# Altium schematic sheet Sensor.SchDoc
size A
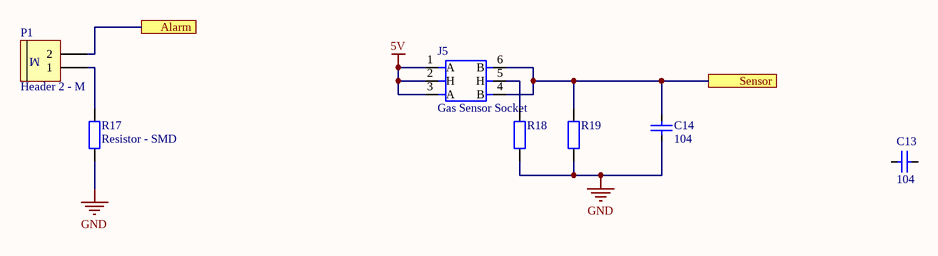
[diagram p0: Sensor.SchDoc]

## Parts
C13  104  [CAP_0402]
C14  104  [CAP_0805]
J5  Gas Sensor Socket  [MQ2]
P1  Header 2 - M  [Medium - Header 2]
R17  Resistor - SMD  [RES-SMD-0805]
R18  Resistor - SMD  [RES-SMD-0805]  (value not drawn)
R19  Resistor - SMD  [RES-SMD-0805]  (value not drawn)

## Ports
Alarm, Sensor

## Nets
5V: J5.1(A) J5.2(H) J5.3(A)
GND: C14.1 R17.2 R18.2 R19.2
Alarm: P1.2 ; port Alarm
Sensor: C14.2 J5.4(B) J5.6(B) R19.1 ; port Sensor
NetJ5_5: J5.5(H) R18.1
NetP1_1: P1.1 R17.1

Not connected (* = marked no-connect by the designer): C13 1 2

## Notes on the sheet
- (in symbol Header 2 - M) M

## Library data of the parts
C13 C14 = CapSMD: Capacitor; Value: 33p; Published: 8-Jun-2000; LatestRevisionDate: 17-Jul-2002; LatestRevisionNote: Re-released for DXP Platform.; PackageReference: RAD-0.3; Publisher: Altium Limited
J5 = MQ2
P1 = Header 2 - M: Header, 2-Pin, Medium; LatestRevisionDate: 17-Jul-2002; LatestRevisionNote: Re-released for DXP Platform.; Publisher: Altium Limited
R17-R19 = Resistor - SMD: Resistor SMD; Manufacturer: Generic Components; Class: Passive; Published: 08/06/2000; Publisher: Altium Hobart Technology Centre